# Altium project First_Project.PrjPcb (part 1 of 3)
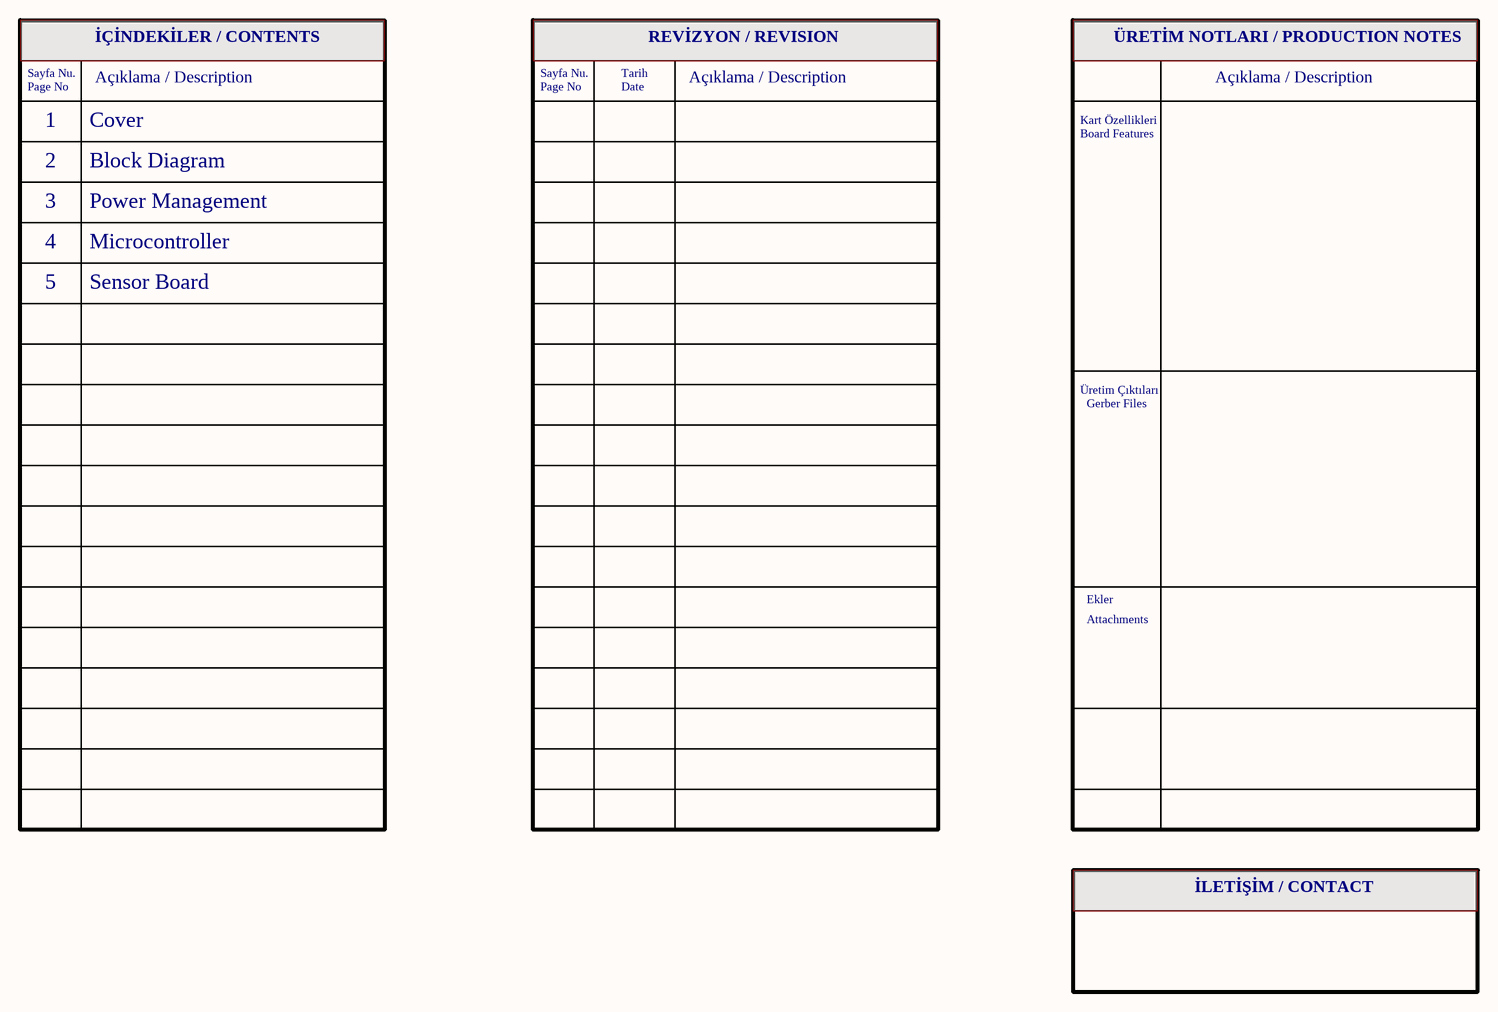
[diagram p0: Cover.SchDoc]
5 sheets, 127 parts. Net scope: flat (ports and power ports of the same name join across sheets).
Board file: PCB1.PcbDoc
Sheets:
  Cover.SchDoc
  Block_Diagram.SchDoc
  Power Management.SchDoc
  Microcontroller.SchDoc
  Sensor Board.SchDoc

## Sheet Cover.SchDoc
size A3; SheetSize: A3; SheetNumber: 1; SheetTotal: 5

### Notes on the sheet
- İÇİNDEKİLER / CONTENTS
- REVİZYON / REVISION
- ÜRETİM NOTLARI / PRODUCTION NOTES
- Sayfa Nu.
- Page No
- Açıklama / Description
- Tarih
- Date
- 1
- 2
- Cover
- Block Diagram
- Board Features
- Kart Özellikleri
- 3
- 4
- Power Management
- Microcontroller
- 5
- Sensor Board
- Üretim Çıktıları
- Gerber Files
- Ekler
- Attachments
- İLETİŞİM / CONTACT
- DOSYA ADI/FILE NAME
- HAZIRLAYAN / PREPARED BY
- YAYIN TARİHİ / REL. DATE
- KONTROL EDEN / CHECKED BY
- ONAYLAYAN / APPROVED BY
- BÖLÜM / DEPARTMENT
- DEĞ. TARİHİ / CHANGED TIME
- BOYUT / SIZE
- SAYFA / SHEET

## Sheet Block_Diagram.SchDoc
size A3; SheetSize: A3; SheetNumber: 3; SheetTotal: 3
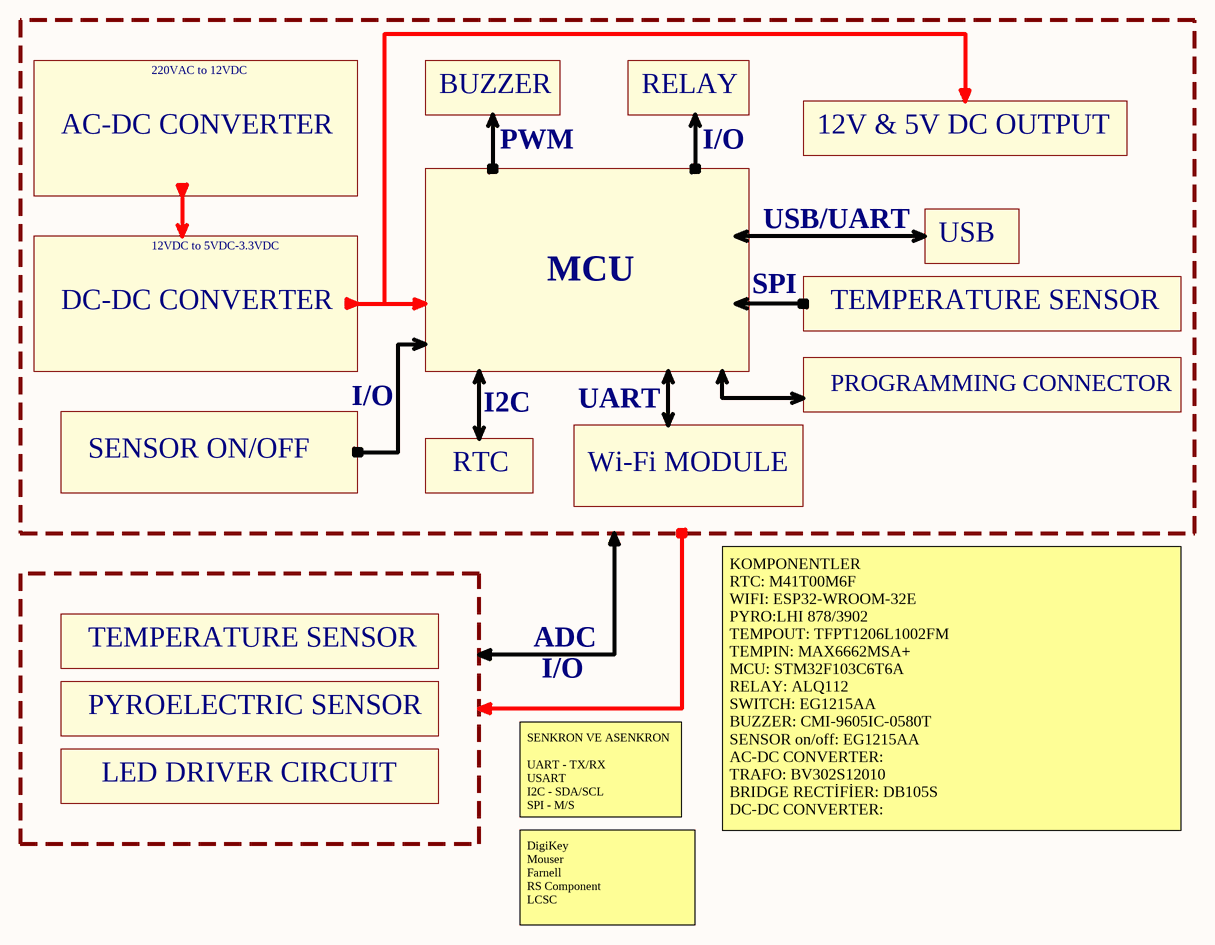
[diagram p1: Block_Diagram.SchDoc]

### Notes on the sheet
- 220VAC to 12VDC
- BUZZER
- RELAY
- AC-DC CONVERTER
- PWM
- I/O
- 12V & 5V DC OUTPUT
- 12VDC to 5VDC-3.3VDC
- USB/UART
- USB
- DC-DC CONVERTER
- MCU
- SPI
- TEMPERATURE SENSOR
- I2C
- UART
- PROGRAMMING CONNECTOR
- SENSOR ON/OFF
- RTC
- Wi-Fi MODULE
- ADC
- PYROELECTRIC SENSOR
- LED DRIVER CIRCUIT
- SENKRON VE ASENKRON
  UART - TX/RX
  USART
  I2C - SDA/SCL
  SPI - M/S
- KOMPONENTLER
  RTC: M41T00M6F
  WIFI: ESP32-WROOM-32E
  PYRO:LHI 878/3902
  TEMPOUT: TFPT1206L1002FM
  TEMPIN: MAX6662MSA+
  MCU: STM32F103C6T6A
  RELAY: ALQ112
  SWITCH: EG1215AA
  BUZZER: CMI-9605IC-0580T
  SENSOR on/off: EG1215AA
  AC-DC CONVERTER:
  TRAFO: BV302S12010
  BRIDGE RECTİFİER: DB105S
  DC-DC CONVERTER:
  5VDC: LM2675MX-12/NOPB
  3V3 LDO: AP7361-33E-13
  LED DRIVER MOSFET: SSM3K357R,LF
- DigiKey
  Mouser
  Farnell
  RS Component
  LCSC
- DOSYA ADI/FILE NAME
- HAZIRLAYAN / PREPARED BY
- YAYIN TARİHİ / REL. DATE
- KONTROL EDEN / CHECKED BY
- ONAYLAYAN / APPROVED BY
- BÖLÜM / DEPARTMENT
- DEĞ. TARİHİ / CHANGED TIME
- REVİZYON / REVISION
- BOYUT / SIZE
- SAYFA / SHEET

## Sheet Power Management.SchDoc
size A3; SheetSize: A3; SheetNumber: 3; SheetTotal: 5
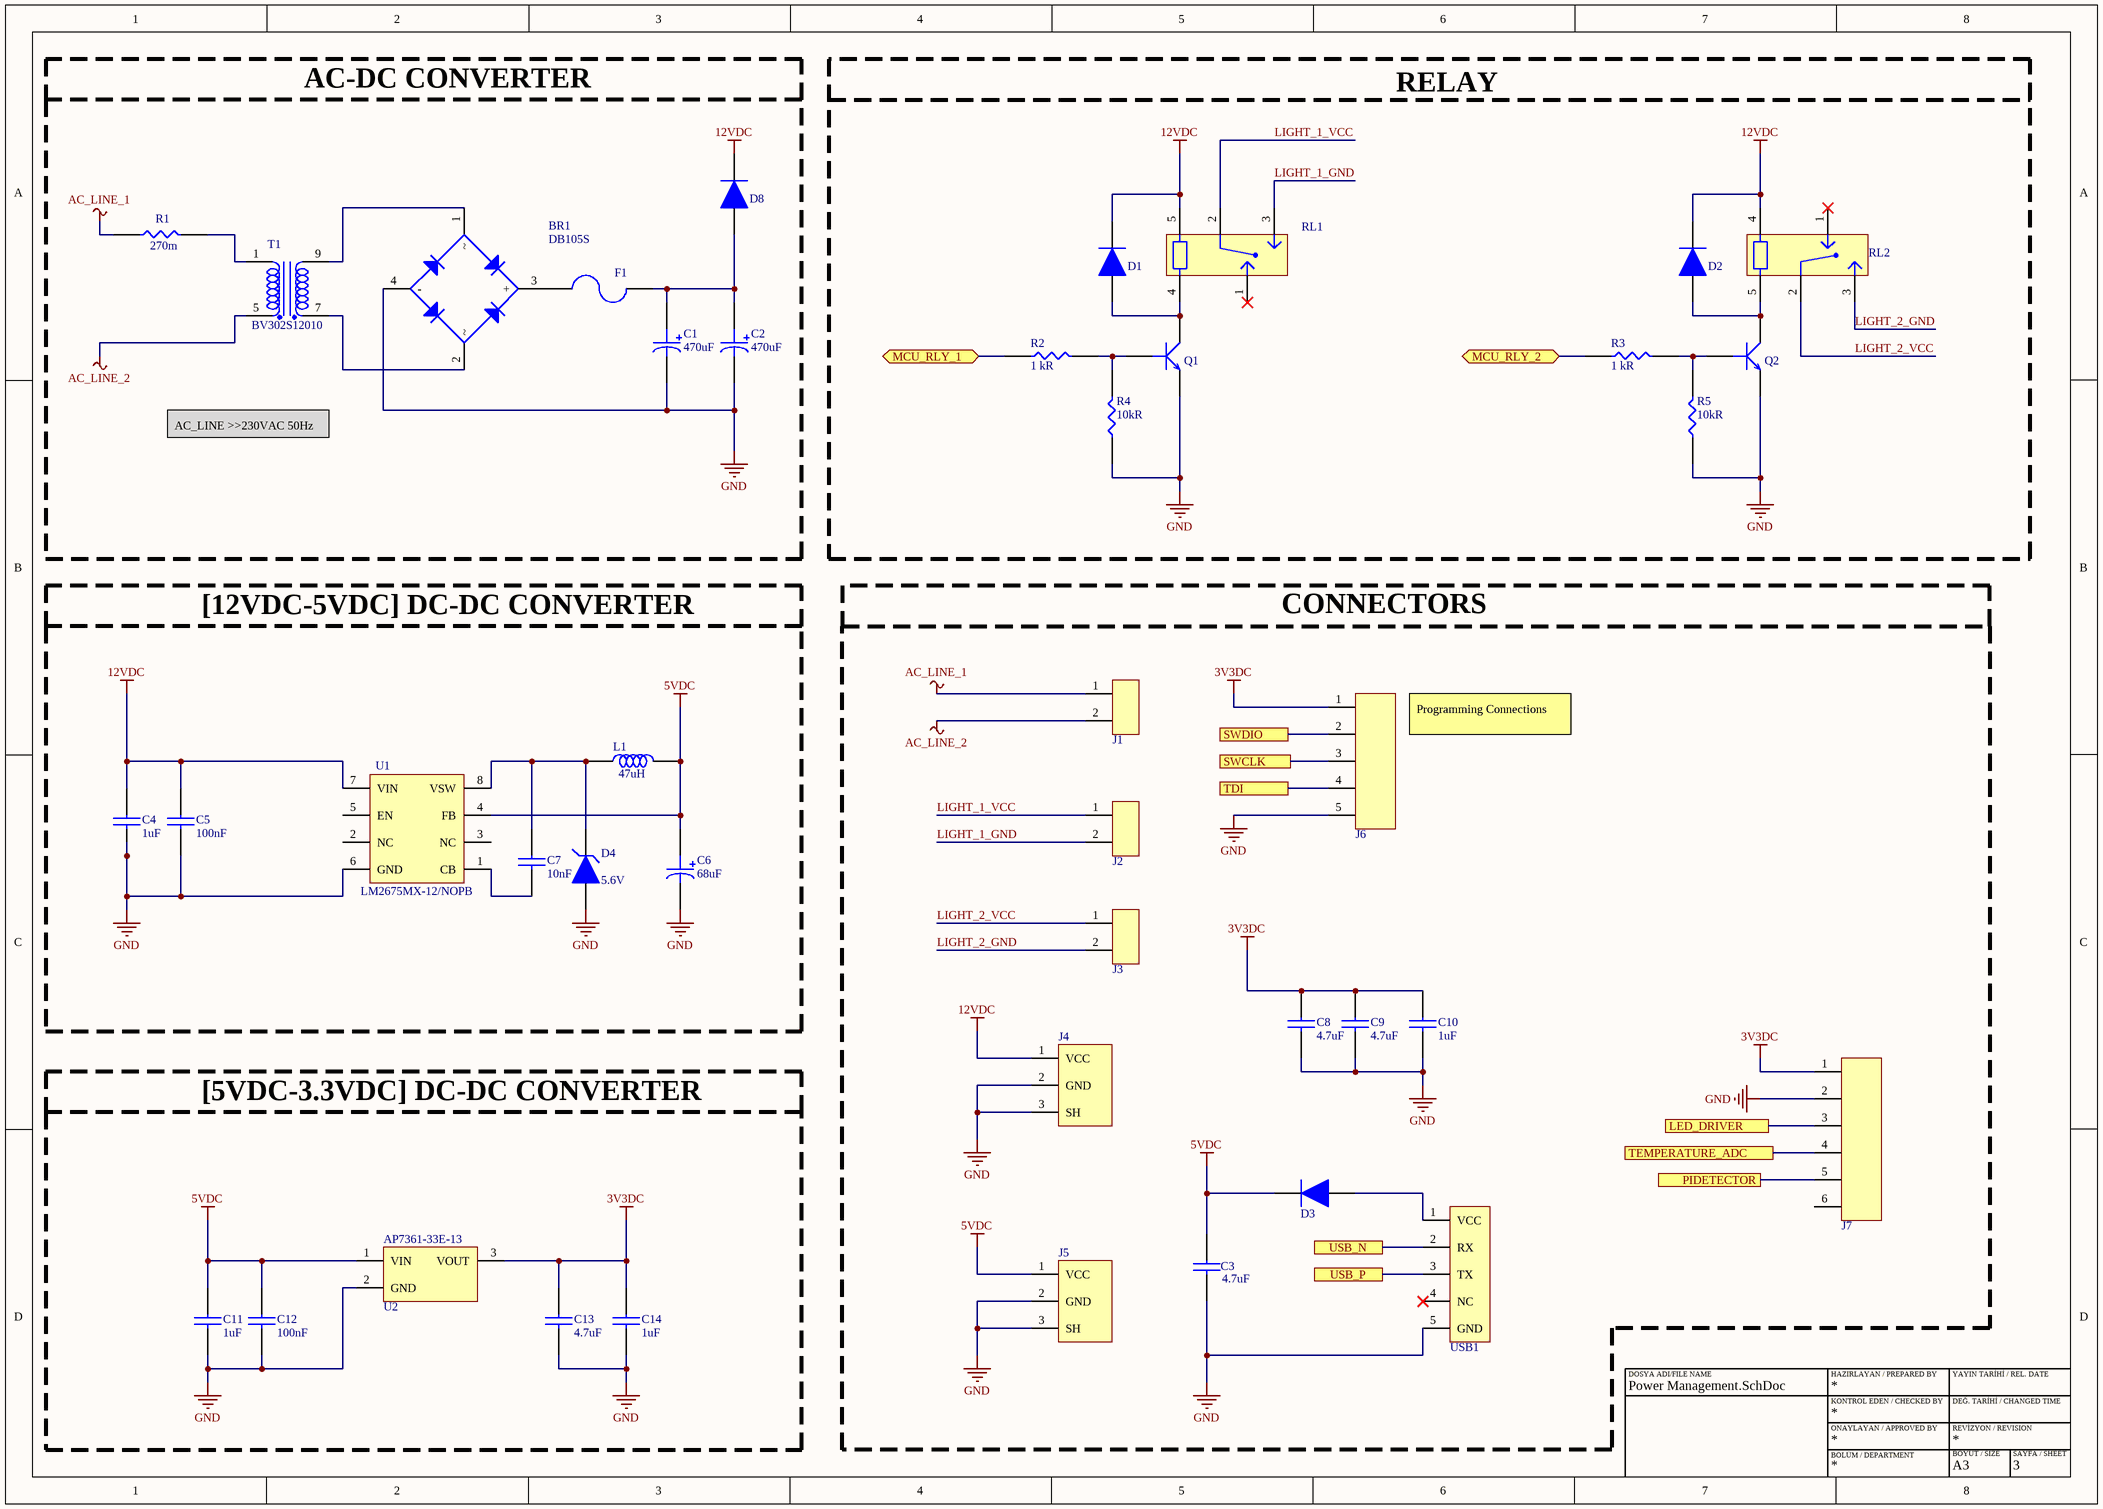
[diagram p2: Power Management.SchDoc]

### Parts
BR1  DB105S  [DB105S]
C1  value 470uF  [CAP_RADIAL_D10_P5]  (hidden comment: ESH477M050AH4AA)
C2  value 470uF  [CAP_RADIAL_D10_P5]  (hidden comment: ESH477M050AH4AA)
C3  value 4.7uF  [CAP_0805]  (hidden comment: CL21A475KAQNNNE)
C4  value 1uF  [CAP_0805]  (hidden comment: CL21B105KBFNNNE)
C5  value 100nF  [CAP_0805]  (hidden comment: CL21B104KBCNNNC)
C6  value 68uF  [CAP_EEVSERIES]  (hidden comment: EEV686M035A9HAA)
C7  value 10nF  [CAP_0603]  (hidden comment: 0603B103K160CT)
C8  value 4.7uF  [CAP_0805]  (hidden comment: CL21A475KAQNNNE)
C9  value 4.7uF  [CAP_0805]  (hidden comment: CL21A475KAQNNNE)
C10  value 1uF  [CAP_0805]  (hidden comment: CL21B105KBFNNNE)
C11  value 1uF  [CAP_0805]  (hidden comment: CL21B105KBFNNNE)
C12  value 100nF  [CAP_0603]  (hidden comment: C0603C104K5RACTU)
C13  value 4.7uF  [CAP_0805]  (hidden comment: CL21A475KAQNNNE)
C14  value 1uF  [CAP_0805]  (hidden comment: CL21B105KBFNNNE)
D1  1N4148WS  [SOD323F]  (value not drawn)
D2  1N4148WS  [SOD323F]  (value not drawn)
D3  1N4148WS  [SOD323F]  (value not drawn)
D4  Reference Voltage-Nom: 5.6V  [SMB]  (hidden comment: 1SMB5919BT3G)
D8  1N4148WS  [SOD323F]  (value not drawn)
F1  3413.0216.22  [FUSE 3413.0216.22]  (value not drawn)
J1  TBP01R1-508-02BE  [TBP01R1-508]  (value not drawn)
J2  TBP01R1-508-02BE  [TBP01R1-508]  (value not drawn)
J3  TBP01R1-508-02BE  [TBP01R1-508]  (value not drawn)
J4  PJ-037AH-SMT-TR  [JACK]  (value not drawn)
J5  PJ-037AH-SMT-TR  [JACK]  (value not drawn)
J6  SMH-105-02-L-S  [PIN_HEADER1X5_RA]  (value not drawn)
J7  64800611622_CONN_6PIN  [64800611622_CONN_6PIN]  (value not drawn)
L1  value 47uH  [IND_1212]  (hidden comment: 78438335470)
Q1  MMBT3904.7.F  [SOT-23F]  (value not drawn)
Q2  MMBT3904.7.F  [SOT-23F]  (value not drawn)
R1  value 270m  [RES_AXIAL_W]  (hidden comment: 5WD27)
R2  value 1 kR  [RES_0603]  (hidden comment: RMCF0603FT1K00)
R3  value 1 kR  [RES_0603]  (hidden comment: RMCF0603FT1K00)
R4  value 10kR  [RES_0603]  (hidden comment: RC0603FR-0710KL)
R5  value 10kR  [RES_0603]  (hidden comment: RC0603FR-0710KL)
RL1  ALQ112  [ALQ112]  (value not drawn)
RL2  ALQ112  [ALQ112]  (value not drawn)
T1  BV302S12010  [BV302S]
U1  LM2675MX-12/NOPB  [SOIC-8]
U2  AP7361-33E-13  [SOT-223]
USB1  10118192.0001LF  [MICRO_B_USB]  (value not drawn)

### Blocks framed on the sheet
RELAY: D1 D2 Q1 Q2 R2-R5 RL1 RL2
AC-DC CONVERTER: BR1 C1 C2 D8 F1 R1 T1
[12VDC-5VDC] DC-DC CONVERTER: C4-C7 D4 L1 U1
CONNECTORS: C3 C8-C10 D3 J1-J7 USB1
[5VDC-3.3VDC] DC-DC CONVERTER: C11-C14 U2

### Ports
LED_DRIVER, MCU_RLY_1 (bidir), MCU_RLY_2 (bidir), PIDETECTOR, SWCLK, SWDIO, TDI, TEMPERATURE_ADC, USB_N, USB_P

### Nets
3V3DC: C8.2 C9.2 C10.2 C13.2 C14.2 J6.1 J7.1 U2.3(VOUT)
5VDC: C3.2 C6.1 C11.2 C12.2 D3.1 J5.1(VCC) L1.2 U1.4(FB) U2.1(VIN)
12VDC: C4.2 C5.2 D1.1 D2.1 D8.1 J4.1(VCC) RL1.5 RL2.4 U1.7(VIN)
AC_LINE_1: J1.1 R1.1
AC_LINE_2: J1.2 T1.5
GND: BR1.4(-) C1.2 C2.2 C3.1 C4.1 C5.1 C6.2 C8.1 C9.1 C10.1 C11.1 C12.1 C13.1 C14.1 D4.A J4.2(GND) J4.3(SH) J5.2(GND) J5.3(SH) J6.5 J7.2 Q1.2(E) Q2.2(E) R4.1 R5.1 U1.6(GND) U2.2(GND) USB1.5(GND)
LIGHT_1_GND: J2.2 RL1.3
LIGHT_1_VCC: J2.1 RL1.2
LIGHT_2_GND: J3.2 RL2.3
LIGHT_2_VCC: J3.1 RL2.2
USB_N: USB1.2(RX) ; port USB_N
USB_P: USB1.3(TX) ; port USB_P
NetBR1_1: BR1.1 T1.9
NetBR1_2: BR1.2 T1.7
NetBR1_3: BR1.3(+) F1.1
NetC1_1: C1.1 C2.1 D8.2 F1.2
NetC7_1: C7.1 U1.1(CB)
NetC7_2: C7.2 D4.C L1.1 U1.8(VSW)
NetD1_2: D1.2 Q1.3(C) RL1.4
NetD2_2: D2.2 Q2.3(C) RL2.5
NetD3_2: D3.2 USB1.1(VCC)
NetJ6_2: J6.2 ; port SWDIO
NetJ6_3: J6.3 ; port SWCLK
NetJ6_4: J6.4 ; port TDI
NetJ7_3: J7.3 ; port LED_DRIVER
NetJ7_4: J7.4 ; port TEMPERATURE_ADC
NetJ7_5: J7.5 ; port PIDETECTOR
NetQ1_1: Q1.1(B) R2.2 R4.2
NetQ2_1: Q2.1(B) R3.2 R5.2
NetR1_2: R1.2 T1.1
NetR2_1: R2.1 ; port MCU_RLY_1
NetR3_1: R3.1 ; port MCU_RLY_2

Not connected (* = marked no-connect by the designer): J7 6; RL1 1*; RL2 1*; U1 2(NC) 3(NC) 5(EN); USB1 4(NC)*

### Notes on the sheet
- AC_LINE >>230VAC 50Hz
- Programming Connections
- DOSYA ADI/FILE NAME
- HAZIRLAYAN / PREPARED BY
- YAYIN TARİHİ / REL. DATE
- KONTROL EDEN / CHECKED BY
- ONAYLAYAN / APPROVED BY
- BÖLÜM / DEPARTMENT
- DEĞ. TARİHİ / CHANGED TIME
- REVİZYON / REVISION
- BOYUT / SIZE
- SAYFA / SHEET

### Library data of the parts
BR1 = DB105S: Rectifier Bridge Diode Single 600V 1A 4-Pin SMD; Manufacturer: Multicomp; Design by: MCP; Supplier: Farnell; Supplier Part Number: 1861407; Manufacturer Part Number: DB105S; RoHS: Yes; Category: Discrete Semiconductors; Stock: 5611; Pricing: 5=0.537, 10=0.429, 100=0.307, 500=0.215, 1000=0.153, 5000=0.134 (EUR); ComponentLink1URL: https://datasheet.ciiva.com/1174/1441678-1174528.pdf?src-supplier=Element14; ComponentLink1Description: https://datasheet.ciiva.com/1174/1441678-1174528.pdf?src-supplier=Element14; ComponentLink2URL: https://datasheet.ciiva.com/1235/1498392-1235776.pdf?src-supplier=Newark; ComponentLink2Description: https://datasheet.ciiva.com/1235/1498392-1235776.pdf?src-supplier=Newark; ComponentLink3URL: https://datasheet.ciiva.com/1235/90r8586-1235777.pdf?src-supplier=Newark; ComponentLink3Description: https://datasheet.ciiva.com/1235/90r8586-1235777.pdf?src-supplier=Newark
C1 C2 = CAP ALU ELEC 470uF 50V: CAP ALU ELEC 470uF 50V 20%; Manufacturer: KEMET; Designed by: MCP; Dielectric Material: Aluminium; Polarity: Polarized; Leakage Current: 235uA; Ripple Current: 630mA; Tan Delta: 0.12; Supplier: Mouser; Supplier Part Number: 80-ESH477M050AH4AA; Manufacturer Part Number: ESH477M050AH4AA; RoHS: Yes; Category: Capacitors; Stock: 682; Pricing: 1=0.54, 10=0.338, 50=0.338, 100=0.251, 1000=0.194, 10000=0.174 (USD); Mounting Technology: Through Hole; Pins: 2; Package Shape: Cylindrical; Min Operating Temperature: -40°C; Max Operating Temperature: 105°C; Capacitor Type: Aluminium; Tolerance  (fill in as +-): 20%; Packaging: Bulk; Tolerance (fill in as +-): 20%; Rated DC Voltage (URdc): 50V; Termination: Wire; Reach SVHC Compliant: Yes; RoHS Compliant: Yes; ComponentLink1URL: https://datasheet.ciiva.com:443/pdfs/VipMasterIC/IC/KEME/KEME-S-A0008512286/KEME-S-A0008512286-1.pdf?src-supplier=IHS+Markit; ComponentLink1Description: https://datasheet.ciiva.com:443/pdfs/VipMasterIC/IC/KEME/KEME-S-A0008512286/KEME-S-A0008512286-1.pdf?src-supplier=IHS+Markit; ComponentLink2URL: https://api.kemet.com/component-edge/download/datasheet/ESH477M050AH4AA.pdf?src-supplier=Digikey; ComponentLink2Description: https://api.kemet.com/component-edge/download/datasheet/ESH477M050AH4AA.pdf?src-supplier=Digikey; ComponentLink3URL: https://datasheet.octopart.com/ESH477M050AH4AA-KEMET-datasheet-130075338.pdf?src-supplier=Newark; ComponentLink3Description: https://datasheet.octopart.com/ESH477M050AH4AA-KEMET-datasheet-130075338.pdf?src-supplier=Newark; ComponentLink4URL: https://datasheet.octopart.com/ESH477M050AH4AA-KEMET-datasheet-157246171.pdf?src-supplier=Element14; ComponentLink4Description: https://datasheet.octopart.com/ESH477M050AH4AA-KEMET-datasheet-157246171.pdf?src-supplier=Element14
C3 C8 C9 C13 = CAP CER 4.7uF 0805: CAP CER 4.7uF 10% 0805; Manufacturer: Samsung; Dielectric Material: Ceramic; Multilayer: Yes; Rated DC Voltage (URdc): 25V; Temperature Characteristics Code: X5R; Designed by: MCP; Supplier: Mouser; Supplier Part Number: 187-CL21A475KAQNNNE; Manufacturer Part Number: CL21A475KAQNNNE; RoHS: Yes; Category: Ceramic Capacitors; Stock: 107749; Pricing: 1=0.1, 10=0.057, 50=0.057, 100=0.034, 1000=0.022, 10000=0.012 (USD); Mounting Technology: Surface Mount; Pins: 2; Package Shape: Rectangular; Case/Package: 0805; Terminal Finish: Nickel; Min Operating Temperature: -55°C; Max Operating Temperature: 85°C; JESD-609 Code: e3; Capacitor Type: Ceramic; Tolerance  (fill in as +-): 10%; Package Style: SMTMeter; Packaging: Tape and Reel; Tolerance (fill in as +-): 10%; Termination: Wraparound; Length: 2mm; Width: 1.25mm; Height: 1.4mm; Reach SVHC Compliant: Yes; RoHS Compliant: Yes; ComponentLink1URL: https://datasheet.ciiva.com:443/pdfs/VipMasterIC/IC/SEMS/SEMS-S-A0008528919/SEMS-S-A0008528938-1.pdf?src-supplier=IHS+Markit; ComponentLink1Description: https://datasheet.ciiva.com:443/pdfs/VipMasterIC/IC/SEMS/SEMS-S-A0008528919/SEMS-S-A0008528938-1.pdf?src-supplier=IHS+Markit; ComponentLink2URL: https://datasheet.ciiva.com/25798/cl21a475kaqnnne-25798882.pdf?src-supplier=Digikey; ComponentLink2Description: https://datasheet.ciiva.com/25798/cl21a475kaqnnne-25798882.pdf?src-supplier=Digikey
C4 C10 C11 C14 = CAP CER 1uF 0805: CAP CER 1uF 10% 0805; Manufacturer: Samsung; Dielectric Material: Ceramic; Multilayer: Yes; Rated DC Voltage (URdc): 50V; Temperature Characteristics Code: X7R; Designed by: MCP; Supplier: Mouser; Supplier Part Number: 187-CL21B105KBFNNNE; Manufacturer Part Number: CL21B105KBFNNNE; RoHS: Yes; Category: Ceramic Capacitors; Stock: 340112; Pricing: 1=0.1, 10=0.024, 50=0.024, 100=0.016, 1000=0.013, 10000=0.011 (USD); Mounting Technology: Surface Mount; Pins: 2; Package Shape: Rectangular; Case/Package: 0805; Terminal Finish: Nickel; Min Operating Temperature: -55°C; Max Operating Temperature: 125°C; JESD-609 Code: e3; Capacitor Type: Ceramic; Tolerance  (fill in as +-): 10%; Package Style: SMTMeter; Packaging: Tape and Reel; Tolerance (fill in as +-): 10%; Termination: Wraparound; Length: 2mm; Width: 1.25mm; Height: 1.35mm; Reach SVHC Compliant: Yes; RoHS Compliant: Yes; ComponentLink1URL: https://datasheet.ciiva.com:443/pdfs/VipMasterIC/IC/SEMS/SEMS-S-A0008524728/SEMS-S-A0008523023-1.pdf?src-supplier=IHS+Markit; ComponentLink1Description: https://datasheet.ciiva.com:443/pdfs/VipMasterIC/IC/SEMS/SEMS-S-A0008524728/SEMS-S-A0008523023-1.pdf?src-supplier=IHS+Markit; ComponentLink2URL: https://datasheet.ciiva.com/16449/cl21b105kbfnnne-16449003.pdf?src-supplier=Future+Electronics; ComponentLink2Description: https://datasheet.ciiva.com/16449/cl21b105kbfnnne-16449003.pdf?src-supplier=Future+Electronics; ComponentLink3URL: https://datasheet.ciiva.com/25800/cl21b105kbfnnne-25800291.pdf?src-supplier=Digikey; ComponentLink3Description: https://datasheet.ciiva.com/25800/cl21b105kbfnnne-25800291.pdf?src-supplier=Digikey
C5 = CAP CER 100nF 0805: CAP CER 100nF 10% 0805; Manufacturer: Samsung; Designed by: MCP; Dielectric Material: Ceramic; Multilayer: Yes; Rated DC Voltage (URdc): 50V; Temperature Characteristics Code: X7R; Supplier: Mouser; Supplier Part Number: 187-CL21B104KBCNNNC; Manufacturer Part Number: CL21B104KBCNNNC; RoHS: Yes; Category: Ceramic Capacitors; Stock: 24455; Pricing: 1=0.1, 10=0.008, 50=0.008, 100=0.008, 1000=0.008, 10000=0.006 (USD); Mounting Technology: Surface Mount; Pins: 2; Package Shape: Rectangular; Case/Package: 0805; Terminal Finish: Nickel; Min Operating Temperature: -55°C; Max Operating Temperature: 125°C; JESD-609 Code: e3; Capacitor Type: Ceramic; Tolerance  (fill in as +-): 10%; Package Style: SMTMeter; Packaging: Tape and Reel; Tolerance (fill in as +-): 10%; Termination: Wraparound; Length: 2mm; Width: 1.25mm; Height: 0.95mm; Reach SVHC Compliant: Yes; RoHS Compliant: Yes; ComponentLink1URL: https://datasheet.ciiva.com:443/pdfs/VipMasterIC/IC/SEMS/SEMS-S-A0008521003/SEMS-S-A0008521039-1.pdf?src-supplier=IHS+Markit; ComponentLink1Description: https://datasheet.ciiva.com:443/pdfs/VipMasterIC/IC/SEMS/SEMS-S-A0008521003/SEMS-S-A0008521039-1.pdf?src-supplier=IHS+Markit; ComponentLink2URL: https://datasheet.ciiva.com/25710/cl21b104kbcnnnc-25710182.pdf?src-supplier=Digikey; ComponentLink2Description: https://datasheet.ciiva.com/25710/cl21b104kbcnnnc-25710182.pdf?src-supplier=Digikey; ComponentLink3URL: https://datasheet.ciiva.com/29199/454152-da-01-en-vs-kondensator-0805-29199814.pdf?src-supplier=Conrad; ComponentLink3Description: https://datasheet.ciiva.com/29199/454152-da-01-en-vs-kondensator-0805-29199814.pdf?src-supplier=Conrad
C6 = CAP ALU 68uF: CAP ALU 68uF 20%; Manufacturer: KEMET; Dielectric Material: Aluminium; Polarity: Polarized; ESR (Equivalent Series Resistance): 340mR; Leakage Current: 23.8uA; Rated DC Voltage (URdc): 35V; Ripple Current: 196mA; Tan Delta: 0.12; Designed by: MCP; Supplier: Mouser; Supplier Part Number: 80-EEV686M035A9HAA; Manufacturer Part Number: EEV686M035A9HAA; RoHS: Yes; Category: Aluminum Electrolytic Capacitors; Stock: 4374; Pricing: 1=0.61, 10=0.294, 50=0.294, 100=0.262, 1000=0.162, 10000=0.144 (USD); Mounting Technology: Surface Mount; Pins: 2; Package Shape: Cylindrical; Case/Package: 2626; Min Operating Temperature: -55°C; Max Operating Temperature: 105°C; Capacitor Type: Aluminium; Tolerance  (fill in as +-): 20%; Package Style: SMTMeter; Packaging: Tape and Reel; Tolerance (fill in as +-): 20%; Termination: Flat; Length: 7.8mm; Width: 6.6mm; Height: 7.7mm; Reach SVHC Compliant: Yes; RoHS Compliant: Yes; ComponentLink1URL: https://datasheet.ciiva.com:443/pdfs/VipMasterIC/IC/KEME/KEME-S-A0008611149/KEME-S-A0008611149-1.pdf?src-supplier=IHS+Markit; ComponentLink1Description: https://datasheet.ciiva.com:443/pdfs/VipMasterIC/IC/KEME/KEME-S-A0008611149/KEME-S-A0008611149-1.pdf?src-supplier=IHS+Markit; ComponentLink2URL: https://datasheet.ciiva.com/5365/kem-a4002-eev-535332-5365784.pdf?src-supplier=Mouser; ComponentLink2Description: https://datasheet.ciiva.com/5365/kem-a4002-eev-535332-5365784.pdf?src-supplier=Mouser
C7 = CAP CER 10nF 0603: CAP CER 10nF 10% 0603; Manufacturer: Walsin Technologies; Dielectric Material: Ceramic; Multilayer: Yes; Rated DC Voltage (URdc): 16V; Temperature Characteristics Code: X7R; Designed by: MCP; Supplier: Mouser; Supplier Part Number: 791-0603B103K160CT; Manufacturer Part Number: 0603B103K160CT; RoHS: Yes; Category: Ceramic Capacitors; Stock: 5929; Pricing: 1=0.1, 10=0.017, 50=0.017, 100=0.01, 1000=0.006, 10000=0.003 (USD); Mounting Technology: Surface Mount; Pins: 2; Case/Package: 0603; Package Shape: Rectangular; Terminal Finish: Nickel; Min Operating Temperature: -55°C; Max Operating Temperature: 125°C; Capacitor Type: Ceramic; Tolerance  (fill in as +-): 10%; Package Style: SMTMeter; Packaging: Tape and Reel; Tolerance (fill in as +-): 10%; JESD-609 Code: e3; Termination: Wraparound; Length: 1.6mm; Width: 0.8mm; Height: 0.8mm; Reach SVHC Compliant: Yes; RoHS Compliant: Yes; ComponentLink1URL: https://datasheet.ciiva.com:443/pdfs/VipMasterIC/IC/WATC/WATC-S-A0009550342/WATC-S-A0009550342-1.pdf?src-supplier=IHS+Markit; ComponentLink1Description: https://datasheet.ciiva.com:443/pdfs/VipMasterIC/IC/WATC/WATC-S-A0009550342/WATC-S-A0009550342-1.pdf?src-supplier=IHS+Markit; ComponentLink2URL: http://www.farnell.com/datasheets/1958513.pdf?src-supplier=Farnell; ComponentLink2Description: http://www.farnell.com/datasheets/1958513.pdf?src-supplier=Farnell; ComponentLink3URL: https://datasheet.octopart.com/0603B103K160CT-Walsin-Technologies-datasheet-85392065.pdf?src-supplier=Element14; ComponentLink3Description: https://datasheet.octopart.com/0603B103K160CT-Walsin-Technologies-datasheet-85392065.pdf?src-supplier=Element14; ComponentLink4URL: http://www.passivecomponent.com/wp-content/uploads/2018/10/MLCC.pdf?src-supplier=Digikey; ComponentLink4Description: http://www.passivecomponent.com/wp-content/uploads/2018/10/MLCC.pdf?src-supplier=Digikey; ComponentLink5URL: https://datasheet.octopart.com/0603B103K160CT-Walsin-Technologies-datasheet-136037192.pdf?src-supplier=Future+Electronics; ComponentLink5Description: https://datasheet.octopart.com/0603B103K160CT-Walsin-Technologies-datasheet-136037192.pdf?src-supplier=Future+Electronics; ComponentLink6URL: https://datasheet.octopart.com/0603B103K160CT-Walsin-Technologies-datasheet-62066062.pdf?src-supplier=TME; ComponentLink6Description: https://datasheet.octopart.com/0603B103K160CT-Walsin-Technologies-datasheet-62066062.pdf?src-supplier=TME
C12 = CAP CER 100nF 0603: CAP CER 100nF 10% 0603; Manufacturer: KEMET; Designed by: MCP; Dielectric Material: Ceramic; Multilayer: Yes; Rated DC Voltage (URdc): 50V; Temperature Characteristics Code: X7R; Supplier: Mouser; Supplier Part Number: 80-C0603C104K5R; Manufacturer Part Number: C0603C104K5RACTU; RoHS: Yes; Category: Ceramic Capacitors; Stock: 2563410; Pricing: 1=0.1, 10=0.013, 50=0.013, 100=0.012, 1000=0.012, 10000=0.01 (USD); Mounting Technology: Surface Mount; Pins: 2; Package Shape: Rectangular; Case/Package: 0603; Terminal Finish: Nickel; Min Operating Temperature: -55°C; Max Operating Temperature: 125°C; JESD-609 Code: e3; Capacitor Type: Ceramic; Tolerance  (fill in as +-): 10%; Package Style: SMTMeter; Packaging: Tape and Reel; Tolerance (fill in as +-): 10%; Termination: Wraparound; Length: 1.6mm; Width: 0.8mm; Height: 0.8mm; Reach SVHC Compliant: Yes; RoHS Compliant: Yes; ComponentLink1URL: https://datasheet.ciiva.com:443/pdfs/VipMasterIC/IC/KEME/KEME-S-A0008991654/KEME-S-A0008991654-1.pdf?src-supplier=IHS+Markit; ComponentLink1Description: https://datasheet.ciiva.com:443/pdfs/VipMasterIC/IC/KEME/KEME-S-A0008991654/KEME-S-A0008991654-1.pdf?src-supplier=IHS+Markit; ComponentLink2URL: https://datasheet.ciiva.com/7823/kem-c1002-x7r-smd-7823591.pdf?src-supplier=Element14; ComponentLink2Description: https://datasheet.ciiva.com/7823/kem-c1002-x7r-smd-7823591.pdf?src-supplier=Element14; ComponentLink3URL: https://datasheet.ciiva.com/7823/kem-c1002-x7r-smd-7823592.pdf?src-supplier=Element14; ComponentLink3Description: https://datasheet.ciiva.com/7823/kem-c1002-x7r-smd-7823592.pdf?src-supplier=Element14; ComponentLink4URL: https://datasheet.ciiva.com/28645/1851736-28645640.pdf?src-supplier=Element14; ComponentLink4Description: https://datasheet.ciiva.com/28645/1851736-28645640.pdf?src-supplier=Element14; ComponentLink5URL: https://datasheet.ciiva.com/14585/70095383-14585209.pdf?src-supplier=Allied+Electronics; ComponentLink5Description: https://datasheet.ciiva.com/14585/70095383-14585209.pdf?src-supplier=Allied+Electronics; ComponentLink6URL: https://datasheet.ciiva.com/5999/kem-c1002-x7r-smd-5999400.pdf?src-supplier=Farnell; ComponentLink6Description: https://datasheet.ciiva.com/5999/kem-c1002-x7r-smd-5999400.pdf?src-supplier=Farnell; ComponentLink7URL: https://datasheet.ciiva.com/14602/70095383-14602583.pdf?src-supplier=Allied+Electronics; ComponentLink7Description: https://datasheet.ciiva.com/14602/70095383-14602583.pdf?src-supplier=Allied+Electronics
D1-D3 D8 = 1N4148WS: Diode,150mA, 75V V; Manufacturer: onsemi; Designed by: MCP; Diode Element Material: SILICON; Package Body Material: Plastic; Diode Type: RECTIFIER; Number of Elements: 1; Rep Pk Reverse Voltage-Max: 100V; Reverse Recovery Time-Max: 0.004us; Forward Voltage: 1V; Qualification Status: Not Qualified; Supplier: Mouser; Supplier Part Number: 512-1N4148WS; Manufacturer Part Number: 1N4148WS; RoHS: Yes; Category: Rectifier Diodes; Stock: 1003660; Pricing: 1=0.11, 10=0.066, 50=0.066, 100=0.062, 1000=0.041, 10000=0.019 (USD); Pins: 2; Package Shape: Rectangular; Max Operating Temperature: 150°C; JESD-30 Code: R-PDSO-F2; Max Output current: 150mA; Package Style: SMALL OUTLINEMeter; Surface Mount: Yes; Terminal Form: Flat; Terminal Position: DUAL; Moisture Sensitivity Level: 1; Reach SVHC Compliant: Yes; RoHS Compliant: Yes; ComponentLink1URL: https://datasheet.ciiva.com:443/pdfs/VipMasterIC/IC/ONSM/ONSM-S-A0003392874/ONSM-S-A0003585195-1.pdf?src-supplier=IHS+Markit; ComponentLink1Description: https://datasheet.ciiva.com:443/pdfs/VipMasterIC/IC/ONSM/ONSM-S-A0003392874/ONSM-S-A0003585195-1.pdf?src-supplier=IHS+Markit
D4 = 1SMB5919BT3G: Zener Diode, 5.6V V(Z), 5%, 0.55W, Silicon, Unidirectional, DO-214AA; Manufacturer: onsemi; Package Body Material: Plastic; Number of Elements: 1; Max Power Dissipation: 550mW; Dynamic Impedance-Max: 2R; Test Current: 66.9mA; Time @ Peak Reflow Temperature-Max (s): 40s; Qualification Status: Not Qualified; Designed by: MCP; Supplier: Mouser; Supplier Part Number: 863-1SMB5919BT3G; Manufacturer Part Number: 1SMB5919BT3G; RoHS: Yes; Category: Zener Diodes; Stock: 80988; Pricing: 1=0.36, 10=0.239, 50=0.239, 100=0.115, 1000=0.113, 10000=0.073 (USD); Pins: 2; Diode Element Material: SILICON; Package Shape: Rectangular; Terminal Finish: Tin; Min Operating Temperature: -65°C; Max Operating Temperature: 150°C; JESD-609 Code: e3; Diode Type: ZENER; Moisture Sensitivity Level: 1; Package Style: SMALL OUTLINEMeter; Surface Mount: Yes; Terminal Form: L BEND; Terminal Position: DUAL; Polarity: Unidirectional; Technology: ZENER; Voltage Tol-Max: 5%; Peak Reflow Temperature (Cel): 260°C; RoHS Compliant: Yes; Reach SVHC Compliant: No; JEDEC-95 Code: DO-214AA; ComponentLink1URL: https://datasheet.ciiva.com:443/pdfs/VipMasterIC/IC/ONSM/ONSM-S-A0001810303/ONSM-S-A0001810303-1.pdf?src-supplier=IHS+Markit; ComponentLink1Description: https://datasheet.ciiva.com:443/pdfs/VipMasterIC/IC/ONSM/ONSM-S-A0001810303/ONSM-S-A0001810303-1.pdf?src-supplier=IHS+Markit; ComponentLink2URL: https://datasheet.ciiva.com/27747/1308331-27747654.pdf?src-supplier=Jameco; ComponentLink2Description: https://datasheet.ciiva.com/27747/1308331-27747654.pdf?src-supplier=Jameco; ComponentLink3URL: https://datasheet.ciiva.com/1182/1smb5913bt3-d-1182657.pdf?src-supplier=Element14; ComponentLink3Description: https://datasheet.ciiva.com/1182/1smb5913bt3-d-1182657.pdf?src-supplier=Element14; ComponentLink4URL: https://datasheet.ciiva.com/1182/1smb5913bt3-d-1182658.pdf?src-supplier=Element14; ComponentLink4Description: https://datasheet.ciiva.com/1182/1smb5913bt3-d-1182658.pdf?src-supplier=Element14; ComponentLink5URL: https://datasheet.ciiva.com/16311/1smb5913bt3-d-16311847.pdf?src-supplier=Future+Electronics; ComponentLink5Description: https://datasheet.ciiva.com/16311/1smb5913bt3-d-16311847.pdf?src-supplier=Future+Electronics; ComponentLink6URL: https://datasheet.ciiva.com/15198/getdatasheetpartid-311040-15198695.pdf?src-supplier=Verical; ComponentLink6Description: https://datasheet.ciiva.com/15198/getdatasheetpartid-311040-15198695.pdf?src-supplier=Verical; ComponentLink7URL: https://datasheet.ciiva.com/895/1smb5913bt3-d-895204.pdf?src-supplier=Digikey; ComponentLink7Description: https://datasheet.ciiva.com/895/1smb5913bt3-d-895204.pdf?src-supplier=Digikey; ComponentLink8URL: https://datasheet.ciiva.com/895/1smb5913bt3-d-895205.pdf?src-supplier=Digikey; ComponentLink8Description: https://datasheet.ciiva.com/895/1smb5913bt3-d-895205.pdf?src-supplier=Digikey; ComponentLink9URL: https://datasheet.ciiva.com/895/1smb5913bt3-d-895203.pdf?src-supplier=Digikey; ComponentLink9Description: https://datasheet.ciiva.com/895/1smb5913bt3-d-895203.pdf?src-supplier=Digikey
F1 = FUSE 3413.0216.22: Electric Fuse, Very Fast Blow, 1A, 32VAC, 63VDC, 63A (IR), Surface Mount, 1206; Manufacturer: Schurter; Designed by: MCP; Joule-integral-Nom: 0.2J; Pre-arcing time-Min: 1ms; Voltage Rating: 32V; Body Breadth: 1.6mm; Body Height: 0.6mm; Body Length or Diameter: 3.2mm; Reference Standard: UL; Supplier: Mouser; Supplier Part Number: 693-3413.0216.22; Manufacturer Part Number: 3413.0216.22; RoHS: Yes; Category: Fuses; Stock: 2988; Pricing: 1=0.67, 10=0.67, 50=0.524, 100=0.468, 1000=0.443, 10000=0.386 (USD); Mounting Technology: Surface Mount; Terminal Finish: Nickel; Min Operating Temperature: -55°C; Max Operating Temperature: 90°C; JESD-609 Code: e4; Blow Characteristic: VERY FAST; Circuit Protection Type: Electric Fuse; Packaging: Tape and Reel; Rated Breaking Capacity: 63A; Current Rating: 1A; Termination: Wraparound; Reach SVHC Compliant: Yes; RoHS Compliant: Yes; ComponentLink1URL: https://datasheet.ciiva.com:443/pdfs/VipMasterIC/IC/SHRI/SHRI-S-A0004985783/SHRI-S-A0004985783-1.pdf?src-supplier=IHS+Markit; ComponentLink1Description: https://datasheet.ciiva.com:443/pdfs/VipMasterIC/IC/SHRI/SHRI-S-A0004985783/SHRI-S-A0004985783-1.pdf?src-supplier=IHS+Markit; ComponentLink2URL: https://datasheet.ciiva.com/301/typ-usi-1206-301440.pdf?src-supplier=Digikey; ComponentLink2Description: https://datasheet.ciiva.com/301/typ-usi-1206-301440.pdf?src-supplier=Digikey; ComponentLink3URL: https://datasheet.ciiva.com/14102/qousi1206-data-e-14102903.pdf?src-supplier=Distrelec; ComponentLink3Description: https://datasheet.ciiva.com/14102/qousi1206-data-e-14102903.pdf?src-supplier=Distrelec; ComponentLink4URL: https://datasheet.ciiva.com/8264/typ-usi-1206-8264583.pdf?src-supplier=Avnet; ComponentLink4Description: https://datasheet.ciiva.com/8264/typ-usi-1206-8264583.pdf?src-supplier=Avnet; ComponentLink5URL: https://datasheet.ciiva.com/16316/typ-usi-1206-16316588.pdf?src-supplier=Future+Electronics; ComponentLink5Description: https://datasheet.ciiva.com/16316/typ-usi-1206-16316588.pdf?src-supplier=Future+Electronics; ComponentLink6URL: https://datasheet.ciiva.com/301/typ-usi-1206-301439.pdf?src-supplier=Digikey; ComponentLink6Description: https://datasheet.ciiva.com/301/typ-usi-1206-301439.pdf?src-supplier=Digikey; ComponentLink7URL: https://datasheet.ciiva.com/301/typ-usi-1206-301441.pdf?src-supplier=Digikey; ComponentLink7Description: https://datasheet.ciiva.com/301/typ-usi-1206-301441.pdf?src-supplier=Digikey; ComponentLink8URL: https://datasheet.ciiva.com/14541/70160006-14541114.pdf?src-supplier=Allied+Electronics; ComponentLink8Description: https://datasheet.ciiva.com/14541/70160006-14541114.pdf?src-supplier=Allied+Electronics
J1-J3 = TBP01R1-508-02BE: Strip Terminal Block; Manufacturer: Same Sky; Designed by: MCP; Supplier: Mouser; Supplier Part Number: 490-TBP01R1-508-02BE; Manufacturer Part Number: TBP01R1-508-02BE; RoHS: Yes; Category: Terminal Blocks; Stock: 3288; Pricing: 1=0.24, 10=0.163, 50=0.134, 100=0.123, 1000=0.096, 10000=0.08 (USD); ComponentLink1URL: https://www.cuidevices.com/product/resource/digikeypdf/tbp01r1-508.pdf?src-supplier=Digikey; ComponentLink1Description: https://www.cuidevices.com/product/resource/digikeypdf/tbp01r1-508.pdf?src-supplier=Digikey; ComponentLink2URL: https://datasheet.octopart.com/TBP01R1-508-02BE-Same-Sky-datasheet-182050293.pdf?src-supplier=Future+Electronics; ComponentLink2Description: https://datasheet.octopart.com/TBP01R1-508-02BE-Same-Sky-datasheet-182050293.pdf?src-supplier=Future+Electronics; ComponentLink3URL: https://datasheet.octopart.com/TBP01R1-508-02BE-Same-Sky-datasheet-182881516.pdf?src-supplier=Electro+Sonic; ComponentLink3Description: https://datasheet.octopart.com/TBP01R1-508-02BE-Same-Sky-datasheet-182881516.pdf?src-supplier=Electro+Sonic; ComponentLink4URL: https://datasheet.octopart.com/TBP01R1-508-02BE-Same-Sky-datasheet-189105742.pdf?src-supplier=Master+Electronics; ComponentLink4Description: https://datasheet.octopart.com/TBP01R1-508-02BE-Same-Sky-datasheet-189105742.pdf?src-supplier=Master+Electronics
J4 J5 = PJ-037AH-SMT-TR: DC Power Connectors Power Jacks; Designed by: MCP
J6 = SMH-105-02-L-S: Board Connector, 5 Contact(s), 1 Row(s), Female, Right Angle, 0.1 inch Pitch, Surface Mount Terminal, Locking, Black Insulator, Socket; Manufacturer: Samtec; Designed by: MCP; Contact Pattern: RECTANGULAR; Contact Style: SQ PIN-SKT; Number Of Connectors: 1; Polarization Key: POLARIZED HOUSING; Number of Contacts: 5; Option: General Purpose; Filter Feature: No; Mating Information: MULTIPLE MATING PARTS AVAILABLE; Body Breadth: 0.095inch; Body Depth: 0.47inch; Body Length: 0.52inch; Plating Thickness: 10uin; Reference Standard: UL; Reliability: COMMERCIAL; Supplier: Mouser; Supplier Part Number: 200-SMH10502LS; Manufacturer Part Number: SMH-105-02-L-S; RoHS: Yes; Category: Connectors; Stock: 103; Pricing: 1=2.05, 10=2.05, 50=2.05, 100=1.59, 1000=1.09, 10000=0.669 (USD); Mounting Technology: Board; Contact Material: Bronze; Contact Finish - Termination: Tin (Sn) - with Nickel (Ni) barrier; Contact Finish - Mating: GOLD (10) OVER NICKEL (50); Insulation Color: Black; Insulation Material: Polymer; Connector Type: BOARD CONNECTOR; JESD-609 Code: e3; Contact Gender: Female; Mounting Style: RIGHT ANGLE; Number Of PCB Rows: 1; Number of Rows Loaded: 1; PCB Contact Pattern: RECTANGULAR; Termination: SMD/SMT; Body/Shell Style: SOCKET; Mixed Contacts: No; Mating Contact Pitch: 0.1inch; Mounting Option 1: LOCKING; Terminal Pitch: 2.54mm; Reach SVHC Compliant: Yes; RoHS Compliant: Yes; DIN Conformance: No; IEC Conformance: No; MIL Conformance: No; ComponentLink1URL: https://datasheet.ciiva.com:443/pdfs/VipMasterIC/IC/SAMI/SAMI-S-A0002821944/SAMI-S-A0002821944-1.pdf?src-supplier=IHS+Markit; ComponentLink1Description: https://datasheet.ciiva.com:443/pdfs/VipMasterIC/IC/SAMI/SAMI-S-A0002821944/SAMI-S-A0002821944-1.pdf?src-supplier=IHS+Markit; ComponentLink2URL: http://www.farnell.com/datasheets/1927708.pdf?_ga=2.237598468.569325269.1503285096-1413671594.1503025027&src-supplier=Farnell; ComponentLink2Description: http://www.farnell.com/datasheets/1927708.pdf?_ga=2.237598468.569325269.1503285096-1413671594.1503025027&src-supplier=Farnell; ComponentLink3URL: http://www.samtec.com/documents/webfiles/pdf/SMH.PDF?src-supplier=Newark; ComponentLink3Description: http://www.samtec.com/documents/webfiles/pdf/SMH.PDF?src-supplier=Newark; ComponentLink4URL: http://www.samtec.com/documents/webfiles/pdf/SMH.PDF?src-supplier=Avnet; ComponentLink4Description: http://www.samtec.com/documents/webfiles/pdf/SMH.PDF?src-supplier=Avnet; ComponentLink5URL: http://suddendocs.samtec.com/catalog_english/smh.pdf?src-supplier=Digikey; ComponentLink5Description: http://suddendocs.samtec.com/catalog_english/smh.pdf?src-supplier=Digikey
J7 = 64800611622_CONN_6PIN: 1.50 mm 6 pin connector; Manufacturer: Wurth Electronics; Supplier: Farnell; Supplier Part Number: 3818179; Manufacturer Part Number: 64800611622; RoHS: No; Category: Uncategorized; Stock: 148; Pricing: 10=0.402, 100=0.321, 500=0.283, 1000=0.277, 2500=0.272 (EUR)
L1 = IND 47uH: FIXED IND 47UH 390MA 2.3OHM SMD; Manufacturer: Wurth Electronics; Inductor Type: GENERAL PURPOSE INDUCTOR; Designed by: MCP; Supplier: Mouser; Supplier Part Number: 710-78438335470; Manufacturer Part Number: 78438335470; RoHS: Yes; Category: Fixed Inductors; Stock: 1300; Pricing: 1=1.9, 10=1.9, 50=1.78, 100=1.78, 1000=1.39, 10000=1.23 (USD); Reach SVHC Compliant: Yes; RoHS Compliant: No; ComponentLink1URL: https://datasheet.ciiva.com:443/pdfs/VipMasterIC/IC/MIDC/MIDC-S-A0004708317/MIDC-S-A0004708317-1.pdf?src-supplier=IHS+Markit; ComponentLink1Description: https://datasheet.ciiva.com:443/pdfs/VipMasterIC/IC/MIDC/MIDC-S-A0004708317/MIDC-S-A0004708317-1.pdf?src-supplier=IHS+Markit; ComponentLink2URL: https://media.digikey.com/pdf/Data%20Sheets/Wurth%20Electronics%20PDFs/Q+_Products_Flyer.pdf?src-supplier=Digikey; ComponentLink2Description: https://media.digikey.com/pdf/Data%20Sheets/Wurth%20Electronics%20PDFs/Q+_Products_Flyer.pdf?src-supplier=Digikey
Q1 Q2 = MMBT3904.7.F: Small Signal Bipolar Transistor, 0.2A I(C), 40V V(BR)CEO, 1-Element, NPN, Silicon; Manufacturer: Diodes Zetex; Manufacturer Part Number: MMBT3904-7-F; Package Body Material: Plastic; Additional Feature: HIGH RELIABILITY; Max Collector Current: 200mA; DC Current Gain-Min (hFE): 30; Number of Elements: 1; Power Dissipation-Max (Abs): 300mW; Time @ Peak Reflow Temperature-Max (s): 40s; Transistor Application: SWITCHING; Frequency: 300MHz; Turn-off Time-Max (toff): 250ns; Turn-on Time-Max (ton): 70ns; Qualification Status: Not Qualified; Designed by: MCP; Supplier: Mouser; Supplier Part Number: 621-MMBT3904-F; RoHS: Yes; Category: BJTs; Stock: 1474086; Pricing: 1=0.1, 10=0.063, 50=0.063, 100=0.042, 1000=0.025, 10000=0.016 (USD); Pins: 3; Package Shape: Rectangular; Terminal Finish: Tin; Transistor Element Material: SILICON; Max Operating Temperature: 150°C; JESD-609 Code: e3; Polarity/Channel Type: NPN; Collector-emitter Voltage-Max: 40V; JESD-30 Code: R-PDSO-G3; Moisture Sensitivity Level: 1; Package Style: SMALL OUTLINEMeter; Peak Reflow Temperature (Cel): 260°C; Surface Mount: Yes; Terminal Form: Gull Wing; Terminal Position: DUAL; Reach SVHC Compliant: Yes; RoHS Compliant: Yes; ComponentLink1URL: https://datasheet.ciiva.com:443/pdfs/VipMasterIC/IC/DIOD/DIOD-S-A0003133141/DIOD-S-A0003133141-1.pdf?src-supplier=IHS+Markit; ComponentLink1Description: https://datasheet.ciiva.com:443/pdfs/VipMasterIC/IC/DIOD/DIOD-S-A0003133141/DIOD-S-A0003133141-1.pdf?src-supplier=IHS+Markit; ComponentLink2URL: https://datasheet.ciiva.com/11201/ds30036-11201778.pdf?src-supplier=Avnet; ComponentLink2Description: https://datasheet.ciiva.com/11201/ds30036-11201778.pdf?src-supplier=Avnet; ComponentLink3URL: https://datasheet.ciiva.com/15138/getdatasheetpartid-53265-15138780.pdf?src-supplier=Verical; ComponentLink3Description: https://datasheet.ciiva.com/15138/getdatasheetpartid-53265-15138780.pdf?src-supplier=Verical; ComponentLink4URL: https://datasheet.ciiva.com/22711/1915516-22711750.pdf?src-supplier=Element14; ComponentLink4Description: https://datasheet.ciiva.com/22711/1915516-22711750.pdf?src-supplier=Element14; ComponentLink5URL: https://datasheet.ciiva.com/11198/ds30036-11198999.pdf?src-supplier=Avnet; ComponentLink5Description: https://datasheet.ciiva.com/11198/ds30036-11198999.pdf?src-supplier=Avnet; ComponentLink6URL: https://datasheet.ciiva.com/6361/ds30036-6361256.pdf?src-supplier=Digikey; ComponentLink6Description: https://datasheet.ciiva.com/6361/ds30036-6361256.pdf?src-supplier=Digikey; ComponentLink7URL: https://datasheet.ciiva.com/6361/ds30036-6361254.pdf?src-supplier=Digikey; ComponentLink7Description: https://datasheet.ciiva.com/6361/ds30036-6361254.pdf?src-supplier=Digikey
R1 = 5WD27: Fixed Resistor, Wire Wound, 5W, 0.27ohm, 200V, 5% +/-Tol, 300ppm/Cel, 8738; Manufacturer: NTE Electronics; Designed by: MCP; Temperature Coefficient (ppm/Cel): 300; Lead Diameter: 0.8mm; Lead Length: 38.1mm; Package Height: 9.65mm; Package Length: 22mm; Supplier: Digikey; Supplier Part Number: 2368-5WD27-ND; Manufacturer Part Number: 5WD27; RoHS: Yes; Category: Through-Hole Resistors; Pins: 2; Case/Package: 8738; Tolerance: 5%; Resistor Type: FIXED RESISTOR; Technology: WIRE WOUND; Construction: Wirewound; Package Style: AXIAL; Power: 5W; Working Voltage: 200V; Package Width: 9.65mm; RoHS Compliant: Yes; ComponentLink1URL: https://datasheet.ciiva.com:443/pdfs/VipMasterIC/IC/NTEE/NTEE-S-A0004025222/NTEE-S-A0004025222-1.pdf?src-supplier=IHS+Markit; ComponentLink1Description: https://datasheet.ciiva.com:443/pdfs/VipMasterIC/IC/NTEE/NTEE-S-A0004025222/NTEE-S-A0004025222-1.pdf?src-supplier=IHS+Markit; ComponentLink2URL: https://datasheet.ciiva.com/15772/fivewire-15772442.pdf?src-supplier=Onlinecomponents.com; ComponentLink2Description: https://datasheet.ciiva.com/15772/fivewire-15772442.pdf?src-supplier=Onlinecomponents.com
R2 R3 = RES 1K OHM 0603: Fixed Resistor, Metal Glaze/thick Film, 0.1W, 1000ohm, 75V, 1% +/-Tol, 100ppm/Cel, Surface Mount, 0603; Manufacturer: Stackpole Electronics; Power: 100mW; Rated Temperature: 70°C; Temperature Coefficient (ppm/Cel): 100; Package Height: 0.45mm; Package Length: 1.55mm; Package Width: 0.8mm; Reference Standard: AEC-Q200; Supplier: Mouser; Supplier Part Number: 708-RMCF0603FT1K00; Manufacturer Part Number: RMCF0603FT1K00; RoHS: Yes; Category: Chip SMD Resistors; Stock: 204581; Pricing: 1=0.1, 10=0.018, 50=0.018, 100=0.008, 1000=0.004, 10000=0.002 (USD); Mounting Technology: Surface Mount; Pins: 2; Package Shape: Rectangular; Case/Package: 0603; Terminal Finish: Nickel; Min Operating Temperature: -55°C; Max Operating Temperature: 155°C; Tolerance: 1%; JESD-609 Code: e3; Resistor Type: FIXED RESISTOR; Construction: Rectangular; Packaging: Tape and Reel; Technology: METAL GLAZE/THICK FILM; Termination: Wraparound; Working Voltage: 75V; Reach SVHC Compliant: Yes; RoHS Compliant: Yes; ComponentLink1URL: https://datasheet.ciiva.com:443/pdfs/VipMasterIC/IC/SEIE/SEIE-S-A0009541969/SEIE-S-A0009541969-1.pdf?src-supplier=IHS+Markit; ComponentLink1Description: https://datasheet.ciiva.com:443/pdfs/VipMasterIC/IC/SEIE/SEIE-S-A0009541969/SEIE-S-A0009541969-1.pdf?src-supplier=IHS+Markit; ComponentLink2URL: https://datasheet.octopart.com/RMCF0603FT1K00-Stackpole-Electronics-datasheet-11547379.pdf?src-supplier=Future+Electronics; ComponentLink2Description: https://datasheet.octopart.com/RMCF0603FT1K00-Stackpole-Electronics-datasheet-11547379.pdf?src-supplier=Future+Electronics; ComponentLink3URL: https://www.seielect.com/catalog/SEI-Packaging.pdf?src-supplier=Avnet; ComponentLink3Description: https://www.seielect.com/catalog/SEI-Packaging.pdf?src-supplier=Avnet; ComponentLink4URL: https://www.seielect.com/catalog/SEI-Packaging.pdf?src-supplier=Arrow+Electronics; ComponentLink4Description: https://www.seielect.com/catalog/SEI-Packaging.pdf?src-supplier=Arrow+Electronics; ComponentLink5URL: http://www.seielect.com/Catalog/SEI-rmc.pdf?src-supplier=Future+Electronics; ComponentLink5Description: http://www.seielect.com/Catalog/SEI-rmc.pdf?src-supplier=Future+Electronics; ComponentLink6URL: https://www.seielect.com/catalog/SEI-Packaging.pdf?src-supplier=Verical; ComponentLink6Description: https://www.seielect.com/catalog/SEI-Packaging.pdf?src-supplier=Verical; ComponentLink7URL: https://www.seielect.com/catalog/SEI-RMCF_RMCP.pdf?src-supplier=Avnet; ComponentLink7Description: https://www.seielect.com/catalog/SEI-RMCF_RMCP.pdf?src-supplier=Avnet; ComponentLink8URL: https://www.seielect.com/catalog/sei-rmcf_rmcp.pdf?src-supplier=Digikey; ComponentLink8Description: https://www.seielect.com/catalog/sei-rmcf_rmcp.pdf?src-supplier=Digikey; ComponentLink9URL: https://www.seielect.com/catalog/SEI-Packaging.pdf?src-supplier=Quest; ComponentLink9Description: https://www.seielect.com/catalog/SEI-Packaging.pdf?src-supplier=Quest; ComponentLink10URL: https://datasheet.octopart.com/RMCF0603FT1K00-Stackpole-Electronics-datasheet-189104164.pdf?src-supplier=Master+Electronics; ComponentLink10Description: https://datasheet.octopart.com/RMCF0603FT1K00-Stackpole-Electronics-datasheet-189104164.pdf?src-supplier=Master+Electronics
R4 R5 = RES 10K OHM 0603: Fixed Resistor, Metal Glaze/thick Film, 0.1W, 10000ohm, 75V, 1% +/-Tol, 100ppm/Cel, Surface Mount, 0603; Manufacturer: Yageo; Designed by: MCP; Additional Feature: LASER TRIMMABLE; Power: 100mW; Rated Temperature: 70°C; Temperature Coefficient (ppm/Cel): 100; Package Height: 0.45mm; Package Length: 1.6mm; Package Width: 0.8mm; Supplier: Mouser; Supplier Part Number: 603-RC0603FR-0710KL; Manufacturer Part Number: RC0603FR-0710KL; RoHS: Yes; Category: Chip SMD Resistors; Stock: 2697494; Pricing: 1=0.1, 10=0.009, 50=0.009, 100=0.007, 1000=0.005, 10000=0.002 (USD); Mounting Technology: Surface Mount; Pins: 2; Package Shape: Rectangular; Case/Package: 0603; Terminal Finish: Nickel; Min Operating Temperature: -55°C; Max Operating Temperature: 155°C; Tolerance: 1%; JESD-609 Code: e3; Resistor Type: FIXED RESISTOR; Construction: Chip; Packaging: Tape and Reel; Technology: METAL GLAZE/THICK FILM; Termination: Wraparound; Working Voltage: 75V; Reach SVHC Compliant: Yes; RoHS Compliant: Yes; ComponentLink1URL: https://datasheet.ciiva.com:443/pdfs/VipMasterIC/IC/YAGO/YAGO-S-A0008145938/YAGO-S-A0008145938-1.pdf?src-supplier=IHS+Markit; ComponentLink1Description: https://datasheet.ciiva.com:443/pdfs/VipMasterIC/IC/YAGO/YAGO-S-A0008145938/YAGO-S-A0008145938-1.pdf?src-supplier=IHS+Markit; ComponentLink2URL: https://datasheet.ciiva.com/46440/1868787-46440891.pdf?src-supplier=Element14; ComponentLink2Description: https://datasheet.ciiva.com/46440/1868787-46440891.pdf?src-supplier=Element14; ComponentLink3URL: https://datasheet.ciiva.com/7746/1738695-7746239.pdf?src-supplier=Element14; ComponentLink3Description: https://datasheet.ciiva.com/7746/1738695-7746239.pdf?src-supplier=Element14; ComponentLink4URL: https://datasheet.ciiva.com/7983/443971-7983596.pdf?src-supplier=Element14; ComponentLink4Description: https://datasheet.ciiva.com/7983/443971-7983596.pdf?src-supplier=Element14; ComponentLink5URL: https://datasheet.ciiva.com/7660/38590-7660789.pdf?src-supplier=Element14; ComponentLink5Description: https://datasheet.ciiva.com/7660/38590-7660789.pdf?src-supplier=Element14; ComponentLink6URL: https://datasheet.ciiva.com/22747/443971-22747519.pdf?src-supplier=Element14; ComponentLink6Description: https://datasheet.ciiva.com/22747/443971-22747519.pdf?src-supplier=Element14; ComponentLink7URL: https://datasheet.ciiva.com/15189/getdatasheetpartid-409289-15189591.pdf?src-supplier=Verical; ComponentLink7Description: https://datasheet.ciiva.com/15189/getdatasheetpartid-409289-15189591.pdf?src-supplier=Verical
RL1 RL2 = ALQ112: Power/Signal Relay, 1 Form C, SPDT, Momentary, 0.033A (Coil), 12VDC (Coil), 400mW (Coil), 5A (Contact), 30VDC (Contact), DC Input, Random, AC/DC Output, Through Hole-Straight Mount; Manufacturer: Panasonic; End Contact Material: Silver; Coil Current(DC)-Max: 33mA; Coil Operate Voltage(DC): 9V; Coil Release Voltage(DC): 600mV; Coil Resistance: 360R; Coil Voltage(DC)-Max: 12V; Contact AC Max Power Rating R Load: 1250VA@250VAC; Contact AC Max Rating R Load: 10A@125VAC; Contact Current(AC)-Max: 10A; Contact DC Max Power Rating R Load: 150W@30VDC; Contact DC Max Rating R Load: 5A@30VDC; Contact Resistance: 100mR; Contact Voltage(AC)-Max: 125V; Contact Voltage(DC)-Max: 30V; Dielectric Strength Between Coil and Contacts: 4000Vrms; Dielectric Strength Between Open Contacts: 750Vrms; Insulation Resistance: 1GR; Operate Time: 20ms; PCB Hole Count: 5; Relay Form: 1 FORM C; Body Breadth: 10mm; Body Height: 16mm; Body Length or Diameter: 20mm; Reference Standard: UL; Sealing: MOISTURE PROOF; Design by: MCP; Supplier: Mouser; Supplier Part Number: 769-ALQ112; Manufacturer Part Number: ALQ112; RoHS: Yes; Category: Power Relays; Stock: 1317; Pricing: 1=1.96, 10=1.76, 50=1.71, 100=1.35, 1000=1.16, 10000=1.16 (USD); Mounting Technology: Through Hole; Pins: 5; Weight: 7g; Min Operating Temperature: -40°C; Max Operating Temperature: 85°C; Coil Power: 400mW; Coil Voltage-Nom: 12V; Coil/Input Supply Type: DC; Contact Current(DC)-Max: 5A; Contact/Output Supply Type: AC/DC; Input Switching Control Type: Random; Packaging: Box; Relay Action: MOMENTARY; Relay Function: SPDT; Relay Type: POWER/SIGNAL RELAY; Release Time: 20ms; Termination: Solder; Terminal Length: 0.0042inch; RoHS Compliant: Yes; ComponentLink1URL: https://datasheet.ciiva.com:443/pdfs/VipMasterIC/IC/PANA/PANA-S-A0003568054/PANA-S-A0003568054-1.pdf?src-supplier=IHS+Markit; ComponentLink1Description: https://datasheet.ciiva.com:443/pdfs/VipMasterIC/IC/PANA/PANA-S-A0003568054/PANA-S-A0003568054-1.pdf?src-supplier=IHS+Markit; ComponentLink2URL: https://datasheet.ciiva.com/24388/307ds-61b20-en-lq-24388909.pdf?src-supplier=Onlinecomponents.com; ComponentLink2Description: https://datasheet.ciiva.com/24388/307ds-61b20-en-lq-24388909.pdf?src-supplier=Onlinecomponents.com; Case/Package: ALQ112
T1 = BV302S12010: Split Bobbin Power Transformer, 1VA; Manufacturer: Zettler Magnetics; Designed by: MCP; Supplier: Future Electronics; Supplier Part Number: 9036725; Manufacturer Part Number: BV302S12010; RoHS: No; Category: Uncategorized; Pricing: 15=1.58, 60=1.56, 225=1.53, 375=1.52, 750=1.49 (USD); Reach SVHC Compliant: No; RoHS Compliant: No
U1 = LM2675MX-12/NOPB: Switching Regulator, Voltage-mode, 2.2A, 275kHz Switching Freq-Max, DMOS, PDSO8; Manufacturer: TI National Semiconductor; Designed by: MCP; Package Body Material: Plastic; Control Technique: PULSE WIDTH MODULATION; Max Supply Voltage: 40V; Min Input Voltage: 6.5V; Nominal Supply Voltage: 24V; Channels: 1; Nominal Output Voltage: 12V; Switcher Configuration: BUCK; Time @ Peak Reflow Temperature-Max (s): 40s; Qualification Status: Not Qualified; Supplier: Mouser; Supplier Part Number: 926-LM2675MX-12/NOPB; Manufacturer Part Number: LM2675MX-12/NOPB; RoHS: Yes; Category: Voltage Regulators - Switching; Stock: 2006; Pricing: 1=4.75, 10=3.62, 50=3.34, 100=3.02, 1000=2.66, 10000=2.57 (USD); Case/Package: SOIC; Pins: 8; Package Shape: Rectangular; Terminal Finish: Tin; Min Operating Temperature: -40°C; Max Operating Temperature: 125°C; JESD-609 Code: e3; Throw Configuration: SWITCHING REGULATOR; Control Mode: VOLTAGE-MODE; JESD-30 Code: R-PDSO-G8; Moisture Sensitivity Level: 1; Max Output current: 2.2A; Package Style: SMALL OUTLINEMeter; Peak Reflow Temperature (Cel): 260°C; Surface Mount: Yes; Frequency: 275kHz; Technology: DMOS; Terminal Form: Gull Wing; Terminal Position: DUAL; Length: 4.9mm; Width: 3.9mm; Height - Seated (Max): 1.75mm; Terminal Pitch: 1.27mm; Temperature Grade: AUTOMOTIVE; Reach SVHC Compliant: Yes; RoHS Compliant: Yes; ComponentLink1URL: https://datasheet.ciiva.com:443/pdfs/VipMasterIC/IC/TXII/TXIIS100070/TXIIS168554-1.pdf?src-supplier=IHS+Markit; ComponentLink1Description: https://datasheet.ciiva.com:443/pdfs/VipMasterIC/IC/TXII/TXIIS100070/TXIIS168554-1.pdf?src-supplier=IHS+Markit; ComponentLink2URL: https://datasheet.ciiva.com/41457/001013881-da-01-en-ic-reg-buck-lm2675mx-12-nopb-soic-8-tid-41457896.pdf?src-supplier=Conrad; ComponentLink2Description: https://datasheet.ciiva.com/41457/001013881-da-01-en-ic-reg-buck-lm2675mx-12-nopb-soic-8-tid-41457896.pdf?src-supplier=Conrad; ComponentLink3URL: https://datasheet.ciiva.com/3220/lm2675-3220840.pdf?src-supplier=Avnet; ComponentLink3Description: https://datasheet.ciiva.com/3220/lm2675-3220840.pdf?src-supplier=Avnet
U2 = AP7361-33E-13: Fixed Positive LDO Regulator, 3.3V, 0.7V Dropout, CMOS, PSSO3; Manufacturer: Diodes; Designed by: MCP; Package Body Material: Plastic; Dropout Voltage1-Max: 700mV; Dropout Voltage1-Nom: 500mV; Input Voltage Absolute-Max: 6.5V; Max Supply Voltage: 6V; Min Input Voltage: 4.3V; Channels: 1; Output Current1-Max: 1A; Output Voltage1-Max: 3.399V; Output Voltage1-Min: 3.201V; Regulator Type: FIXED POSITIVE SINGLE OUTPUT LDO REGULATOR; Time @ Peak Reflow Temperature-Max (s): 30s; Voltage Tolerance-Max: 6.5%; Qualification Status: Not Qualified; Supplier: Mouser; Supplier Part Number: 621-AP7361-33E-13; Manufacturer Part Number: AP7361-33E-13; RoHS: Yes; Category: Voltage Regulators - Linear; Stock: 22817; Pricing: 1=0.31, 10=0.212, 50=0.188, 100=0.162, 1000=0.141, 10000=0.135 (USD); Pins: 3; Package Shape: Rectangular; Terminal Finish: Tin; JESD-609 Code: e3; Adjustability: FIXED; Moisture Sensitivity Level: 1; Number of Outputs: 1; Operating Temperature, TJ-Max: 150°C; Operating Temperature, TJ-Min: -40°C; Output Voltage1-Nom: 3.3V; Packaging: Tape and Reel; Peak Reflow Temperature (Cel): 260°C; Surface Mount: Yes; Technology: CMOS; Terminal Form: Gull Wing; Terminal Position: SINGLE; Length: 6.5mm; Width: 3.5mm; Height - Seated (Max): 1.8mm; Terminal Pitch: 2.3mm; Reach SVHC Compliant: Yes; RoHS Compliant: Yes; ComponentLink1URL: https://datasheet.ciiva.com:443/pdfs/VipMasterIC/IC/DIOD/DIOD-S-A0002906110/DIOD-S-A0002906110-1.pdf?src-supplier=IHS+Markit; ComponentLink1Description: https://datasheet.ciiva.com:443/pdfs/VipMasterIC/IC/DIOD/DIOD-S-A0002906110/DIOD-S-A0002906110-1.pdf?src-supplier=IHS+Markit; ComponentLink2URL: https://datasheet.ciiva.com/26926/getdatasheetpartid-670786-26926141.pdf?src-supplier=Verical; ComponentLink2Description: https://datasheet.ciiva.com/26926/getdatasheetpartid-670786-26926141.pdf?src-supplier=Verical; ComponentLink3URL: https://datasheet.ciiva.com/25651/ap7361-25651049.pdf?src-supplier=Digikey; ComponentLink3Description: https://datasheet.ciiva.com/25651/ap7361-25651049.pdf?src-supplier=Digikey
USB1 = Micro B USB Connector: CONN USB MICRO B RECPT SMT R/A; Manufacturer: Amphenol ICC / FCI; Manufacturer Part Number: 10118192-0001LF; Designed by: MCP; Supplier: Mouser; Supplier Part Number: 649-10118192-0001LF; RoHS: No; Category: Uncategorized; Stock: 19546; Pricing: 1=0.43, 10=0.367, 50=0.328, 100=0.312, 1000=0.279, 10000=0.216 (USD)